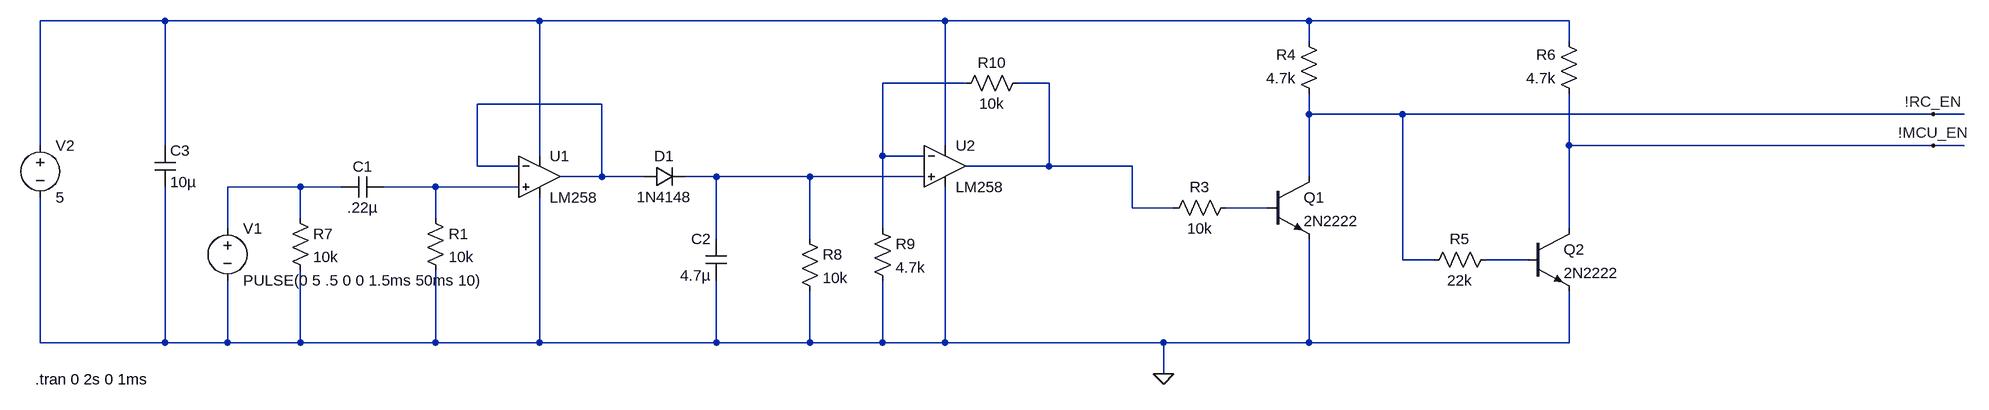
[diagram p0: schematic RC_Switch.asc]
RC_Switch.asc, the LTspice schematic file:
Version 4
SHEET 1 2432 900
WIRE -368 -112 -560 -112
WIRE 208 -112 -368 -112
WIRE 832 -112 208 -112
WIRE 1392 -112 832 -112
WIRE 1792 -112 1392 -112
WIRE 1392 -80 1392 -112
WIRE 1792 -80 1792 -112
WIRE 864 -16 736 -16
WIRE 992 -16 944 -16
WIRE 304 16 112 16
WIRE 1392 32 1392 0
WIRE 1536 32 1392 32
WIRE 2352 32 1536 32
WIRE 2400 32 2352 32
WIRE -560 80 -560 -112
WIRE -368 80 -368 -112
WIRE 832 80 832 -112
WIRE 1792 80 1792 0
WIRE 2352 80 1792 80
WIRE 2400 80 2352 80
WIRE 208 96 208 -112
WIRE 736 96 736 -16
WIRE 800 96 736 96
WIRE 112 112 112 16
WIRE 176 112 112 112
WIRE 992 112 992 -16
WIRE 992 112 864 112
WIRE 1120 112 992 112
WIRE 304 128 304 16
WIRE 304 128 240 128
WIRE 368 128 304 128
WIRE 480 128 432 128
WIRE 624 128 480 128
WIRE 800 128 624 128
WIRE 1392 128 1392 32
WIRE -160 144 -272 144
WIRE -96 144 -160 144
WIRE 48 144 -32 144
WIRE 176 144 48 144
WIRE 1120 176 1120 112
WIRE 1184 176 1120 176
WIRE 1328 176 1264 176
WIRE -160 192 -160 144
WIRE 48 192 48 144
WIRE -272 208 -272 144
WIRE 736 208 736 96
WIRE 1792 208 1792 80
WIRE 480 224 480 128
WIRE 624 224 624 128
WIRE 1536 256 1536 32
WIRE 1584 256 1536 256
WIRE 1728 256 1664 256
WIRE -560 384 -560 160
WIRE -368 384 -368 144
WIRE -368 384 -560 384
WIRE -272 384 -272 288
WIRE -272 384 -368 384
WIRE -160 384 -160 272
WIRE -160 384 -272 384
WIRE 48 384 48 272
WIRE 48 384 -160 384
WIRE 208 384 208 160
WIRE 208 384 48 384
WIRE 480 384 480 288
WIRE 480 384 208 384
WIRE 624 384 624 304
WIRE 624 384 480 384
WIRE 736 384 736 288
WIRE 736 384 624 384
WIRE 832 384 832 144
WIRE 832 384 736 384
WIRE 1168 384 832 384
WIRE 1392 384 1392 224
WIRE 1392 384 1168 384
WIRE 1792 384 1792 304
WIRE 1792 384 1392 384
WIRE 1168 432 1168 384
FLAG 2352 32 !RC_EN
FLAG 2352 80 !MCU_EN
FLAG 1168 432 0
SYMBOL npn 1328 128 R0
SYMATTR InstName Q1
SYMATTR Value 2N2222
SYMBOL cap -32 128 R90
WINDOW 0 0 32 VBottom 0
WINDOW 3 32 32 VTop 0
SYMATTR InstName C1
SYMATTR Value .22µ
SYMBOL cap 496 288 R180
WINDOW 0 24 64 Left 0
WINDOW 3 24 8 Left 0
SYMATTR InstName C2
SYMATTR Value 4.7µ
SYMBOL res 32 176 R0
SYMATTR InstName R1
SYMATTR Value 10k
SYMBOL res 1280 160 R90
WINDOW 0 0 56 VBottom 0
WINDOW 3 32 56 VTop 0
SYMATTR InstName R3
SYMATTR Value 10k
SYMBOL res 1408 16 R180
WINDOW 0 36 76 Left 0
WINDOW 3 36 40 Left 0
SYMATTR InstName R4
SYMATTR Value 4.7k
SYMBOL diode 368 144 R270
WINDOW 0 32 32 VTop 0
WINDOW 3 0 32 VBottom 0
SYMATTR InstName D1
SYMATTR Value 1N4148
SYMBOL voltage -272 192 R0
WINDOW 123 0 0 Left 0
WINDOW 39 0 0 Left 0
SYMATTR InstName V1
SYMATTR Value PULSE(0 5 .5 0 0 1.5ms 50ms 10)
SYMBOL voltage -560 64 R0
WINDOW 123 0 0 Left 0
WINDOW 39 0 0 Left 0
SYMATTR InstName V2
SYMATTR Value 5
SYMBOL npn 1728 208 R0
SYMATTR InstName Q2
SYMATTR Value 2N2222
SYMBOL res 1680 240 R90
WINDOW 0 0 56 VBottom 0
WINDOW 3 32 56 VTop 0
SYMATTR InstName R5
SYMATTR Value 22k
SYMBOL res 1808 16 R180
WINDOW 0 36 76 Left 0
WINDOW 3 36 40 Left 0
SYMATTR InstName R6
SYMATTR Value 4.7k
SYMBOL res -176 176 R0
SYMATTR InstName R7
SYMATTR Value 10k
SYMBOL res 608 208 R0
SYMATTR InstName R8
SYMATTR Value 10k
SYMBOL res 720 192 R0
SYMATTR InstName R9
SYMATTR Value 4.7k
SYMBOL res 960 -32 R90
WINDOW 0 0 56 VBottom 0
WINDOW 3 32 56 VTop 0
SYMATTR InstName R10
SYMATTR Value 10k
SYMBOL Opamps\\LM258 208 64 R0
SYMATTR InstName U1
SYMBOL Opamps\\LM258 832 48 R0
SYMATTR InstName U2
SYMBOL cap -384 80 R0
SYMATTR InstName C3
SYMATTR Value 10µ
TEXT -568 440 Left 0 !.tran 0 2s 0 1ms

The netlist it stands for:
* RC_Switch.asc
Q1 !RC_EN N008 0 0 2N2222
C1 N007 N006 .22µ
C2 0 N005 4.7µ
R1 N007 0 10k
R3 N008 N003 10k
R4 !RC_EN N001 4.7k
D1 N004 N005 1N4148
V1 N006 0 PULSE(0 5 .5 0 0 1.5ms 50ms 10)
V2 N001 0 5
Q2 !MCU_EN N009 0 0 2N2222
R5 N009 !RC_EN 22k
R6 !MCU_EN N001 4.7k
R7 N006 0 10k
R8 N005 0 10k
R9 N002 0 4.7k
R10 N003 N002 10k
XU1 N007 N004 N001 0 N004 LM258  ; pins In+ In- V+ V- OUT
XU2 N005 N002 N001 0 N003 LM258  ; pins In+ In- V+ V- OUT
C3 N001 0 10µ
.model D D
.lib standard.dio
.model NPN NPN
.model PNP PNP
.lib standard.bjt
.tran 0 2s 0 1ms
.backanno
.end